# Altium schematic sheet FumSegwayMainBoard.SchDoc
size C
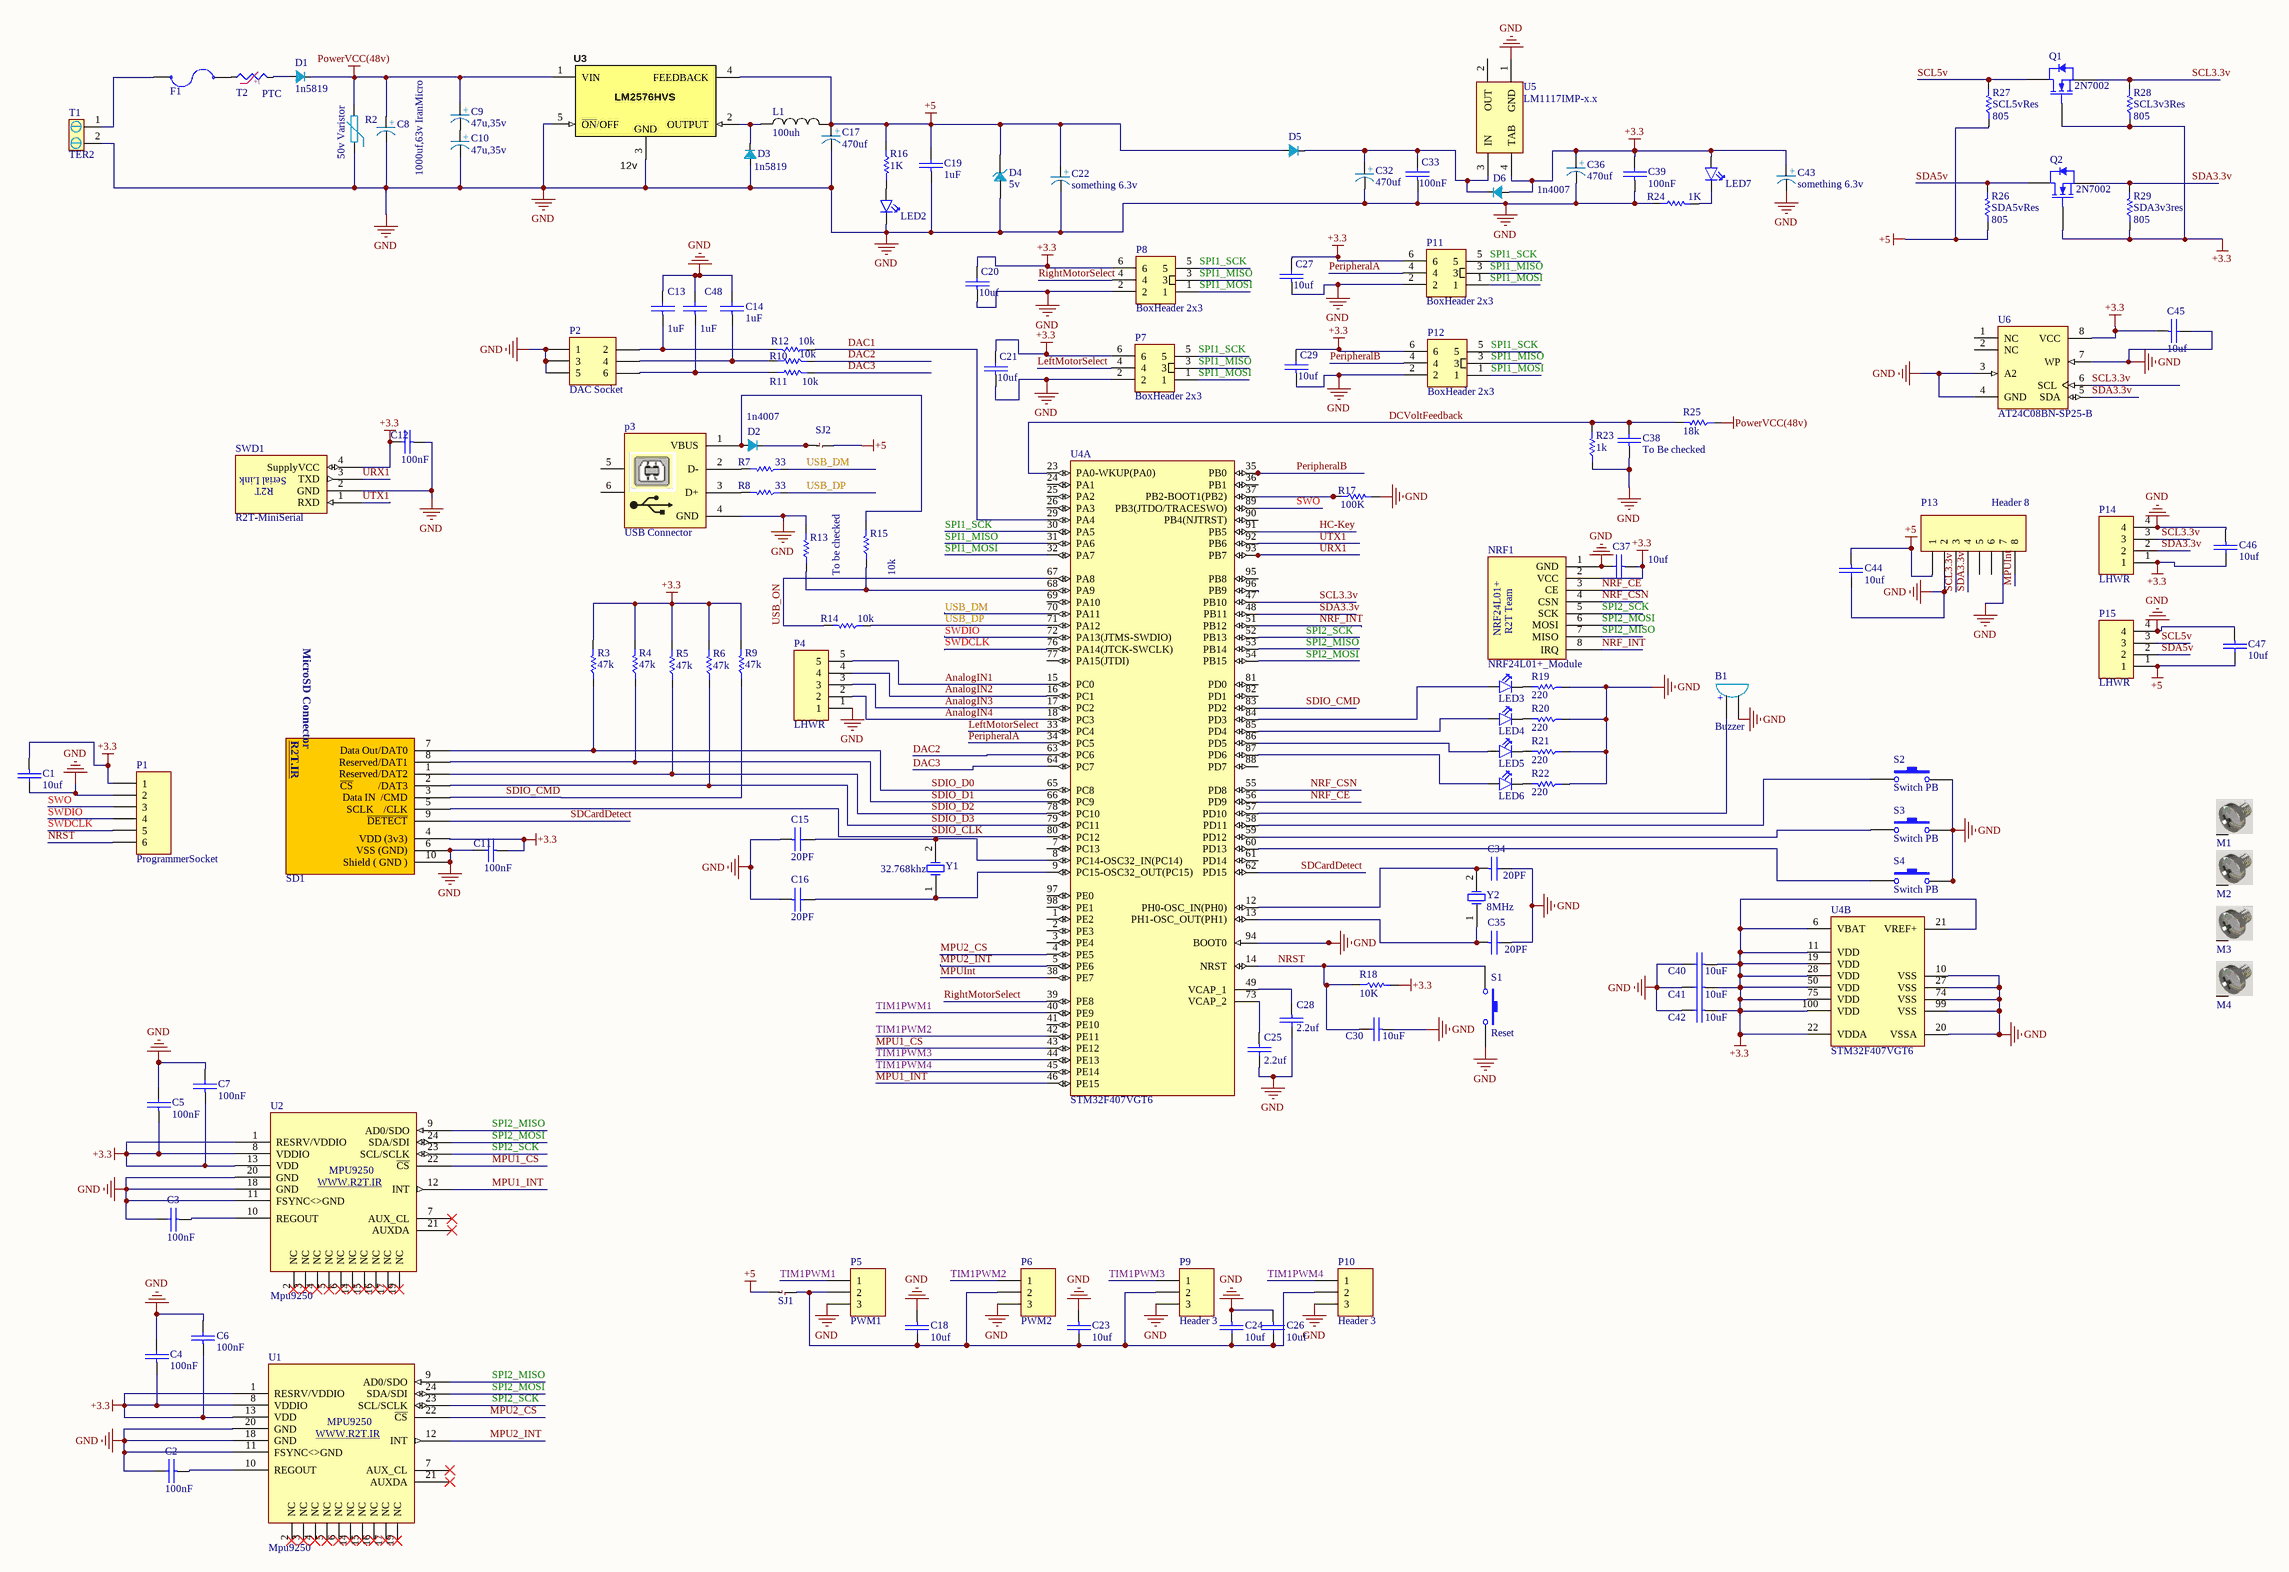
[diagram p0: FumSegwayMainBoard.SchDoc]

## Parts
B1  Buzzer  [Buzzer]
C1  10uf  [SMD_CAP_1206]
C2  100nF  [SMD_CAP_0805]
C3  100nF  [SMD_CAP_0805]
C4  100nF  [SMD_CAP_0805]
C5  100nF  [SMD_CAP_0805]
C6  100nF  [SMD_CAP_0805]
C7  100nF  [SMD_CAP_0805]
C8  Description:: 1000uf,63v IranMicro  [Cap Radial 16MM HV]  (hidden comment: Capacitor Polarized)
C9  Description:: 47u,35v  [Tantalum CAP Size E - 2917]  (hidden comment: Capacitor Polarized)
C10  Description:: 47u,35v  [Tantalum CAP Size E - 2917]  (hidden comment: Capacitor Polarized)
C11  100nF  [SMD_CAP_0805]
C12  100nF  [SMD_CAP_0805]
C13  1uF  [SMD_CAP_1206]
C14  1uF  [SMD_CAP_1206]
C15  20PF  [SMD_CAP_0805]
C16  20PF  [SMD_CAP_0805]
C17  Description:: 470uf  [Electrolytic Capacitor SMD Dia-8]  (hidden comment: Capacitor Polarized)
C18  10uf  [SMD_CAP_1206]
C19  1uF  [SMD_CAP_1206]
C20  10uf  [SMD_CAP_1206]
C21  10uf  [SMD_CAP_1206]
C22  Description:: something 6.3v  [Tantalum Cap Size A - 1206]  (hidden comment: Capacitor Polarized)
C23  10uf  [SMD_CAP_1206]
C24  10uf  [SMD_CAP_1206]
C25  2.2uf  [SMD_CAP_0805]
C26  10uf  [SMD_CAP_1206]
C27  10uf  [SMD_CAP_1206]
C28  2.2uf  [SMD_CAP_0805]
C29  10uf  [SMD_CAP_1206]
C30  10uF  [SMD_CAP_0805]
C32  Description:: 470uf  [Electrolytic Capacitor SMD Dia-8]  (hidden comment: Capacitor Polarized)
C33  100nF  [SMD_CAP_0805]
C34  20PF  [SMD_CAP_0805]
C35  20PF  [SMD_CAP_0805]
C36  Description:: 470uf  [Electrolytic Capacitor SMD Dia-8]  (hidden comment: Capacitor Polarized)
C37  10uf  [SMD_CAP_1206]
C38  To Be checked  [SMD_CAP_1206]
C39  100nF  [SMD_CAP_0805]
C40  10uF  [SMD_CAP_0805]
C41  10uF  [SMD_CAP_0805]
C42  10uF  [SMD_CAP_0805]
C43  Description:: something 6.3v  [Tantalum Cap Size A - 1206]  (hidden comment: Capacitor Polarized)
C44  10uf  [SMD_CAP_1206]
C45  10uf  [SMD_CAP_0805]
C46  10uf  [SMD_CAP_1206]
C47  10uf  [SMD_CAP_1206]
C48  1uF  [SMD_CAP_1206]
D1  Description:: 1n5819  [DO-214AC ( SMD Diode )]  (hidden comment: SMD Diodes)
D2  Description:: 1n4007  [DO-214AC ( SMD Diode )]  (hidden comment: SMD Diodes)
D3  Description:: 1n5819  [DO-214AC ( SMD Diode )]  (hidden comment: SMD Diodes)
D4  5v  [DIOMELF3615N]
D5  SMD Diodes  [DO-214AC ( SMD Diode )]  (value not drawn)
D6  Description:: 1n4007  [DO-214AC ( SMD Diode )]  (hidden comment: SMD Diodes)
F1  Fuse  [Fuse 5x20MM]  (value not drawn)
L1  100uh  [General 10x12(200m) Inductor]
LED2  LED  [LED0805]  (value not drawn)
LED3  LED  [LED0805]  (value not drawn)
LED4  LED  [LED0805]  (value not drawn)
LED5  LED  [LED0805]  (value not drawn)
LED6  LED  [LED0805]  (value not drawn)
LED7  LED  [LED0805]  (value not drawn)
M1  Screw  [Board Screw]  (value not drawn)
M2  Screw  [Board Screw]  (value not drawn)
M3  Screw  [Board Screw]  (value not drawn)
M4  Screw  [Board Screw]  (value not drawn)
NRF1  NRF24L01+_Module  [NRF24L01P_SMD]
P1  ProgrammerSocket  [HDR1X6]
P2  DAC Socket  [HDR2X3]
p3  USB Connector  [USB2.5-2H4F]
P4  LHWR  [Polarized Header 5]
P5  PWM1  [HDR1X3]
P6  PWM2  [HDR1X3]
P7  BoxHeader 2x3  [Box Header 2x3]
P8  BoxHeader 2x3  [Box Header 2x3]
P9  Header 3  [HDR1X3]
P10  Header 3  [HDR1X3]
P11  BoxHeader 2x3  [Box Header 2x3]
P12  BoxHeader 2x3  [Box Header 2x3]
P13  Header 8  [HDR1X8]
P14  LHWR  [Polarized Header 4]
P15  LHWR  [Polarized Header 4]
Q1  2N7002  [SOT23_N]
Q2  2N7002  [SOT23_N]
R2  50v Varistor  [VAR07]
R3  47k  [RES 0805 (2012X06L)]
R4  47k  [RES 0805 (2012X06L)]
R5  47k  [RES 0805 (2012X06L)]
R6  47k  [RES 0805 (2012X06L)]
R7  33  [RES 0805 (2012X06L)]
R8  33  [RES 0805 (2012X06L)]
R9  47k  [RES 0805 (2012X06L)]
R10  10k  [RES 0805 (2012X06L)]
R11  10k  [RES 0805 (2012X06L)]
R12  10k  [RES 0805 (2012X06L)]
R13  To be checked  [RES 0805 (2012X06L)]
R14  10k  [RES 0805 (2012X06L)]
R15  10k  [RES 0805 (2012X06L)]
R16  1K  [RES 0805 (2012X06L)]
R17  100K  [RES 0805 (2012X06L)]
R18  10K  [RES 0805 (2012X06L)]
R19  220  [RES 0805 (2012X06L)]
R20  220  [RES 0805 (2012X06L)]
R21  220  [RES 0805 (2012X06L)]
R22  220  [RES 0805 (2012X06L)]
R23  1k  [RES 0805 (2012X06L)]
R24  1K  [RES 0805 (2012X06L)]
R25  18k  [RES 0805 (2012X06L)]
R26  Tolerance: 805  [RES 0805 (2012X06L)]  (hidden comment: SDA5vRes)
R27  Tolerance: 805  [RES 0805 (2012X06L)]  (hidden comment: SCL5vRes)
R28  Tolerance: 805  [RES 0805 (2012X06L)]  (hidden comment: SCL3v3Res)
R29  Tolerance: 805  [RES 0805 (2012X06L)]  (hidden comment: SDA3v3res)
S1  Reset  [SW-PB]
S2  Switch PB  [SW-PB]
S3  Switch PB  [SW-PB]
S4  Switch PB  [SW-PB]
SD1  MicroSD Card Connector  [MicroSD Card Connector]  (value not drawn)
SJ1  SmdJumper  [SMD Jumper]  (value not drawn)
SJ2  SmdJumper  [SMD Jumper]  (value not drawn)
SWD1  R2T-MiniSerial  [SerialWireMini]
T1  TER2  [TER2]
T2  PTC  [PTC Radial 5mm]
U1  Mpu9250  [MPU9250]
U2  Mpu9250  [MPU9250]
U3  value 12v  [TO-263-5]  (hidden comment: Adjustable)
U4  STM32F407VGT6  [STM-LQFP100_N]  (parts A,B of 2)
U5  LM1117IMP-x.x  [MP04A_N]
U6  AT24C08BN-SP25-B  [8S1_N]
Y1  32.768khz  [XTAL RTC]
Y2  8MHz  [XTAL Small]

## Nets
+3.3: C1.2(-) C4.2(-) C5.2(-) C6.2(-) C7.2(-) C11.2(-) C12.1(+) C20.1(+) C21.1(+) C27.1(+) C29.1(+) C36.1 C37.2(-) C39.1(+) C40.2(-) C41.2(-) C42.2(-) C43.1 C45.2(-) C46.1(+) D6.0 LED7.1(A) NRF1.2(VCC) P1.1 P7.6 P8.6 P11.6 P12.6 P14.1 Q1.1(G) Q2.1(G) R3.2 R4.2 R5.2 R6.2 R9.2 R18.2 R28.1 R29.1 SD1.4(VDD_(3v3)) SWD1.4(SupplyVCC) U1.1(RESRV/VDDIO) U1.8(VDDIO) U1.13(VDD) U2.1(RESRV/VDDIO) U2.8(VDDIO) U2.13(VDD) U4.6(VBAT) U4.11(VDD) U4.19(VDD) U4.21(VREF+) U4.22(VDDA) U4.28(VDD) U4.50(VDD) U4.75(VDD) U4.100(VDD) U5.4(TAB) U6.8(VCC)
+5: C17.1 C19.1(+) C22.1 C44.2(-) C47.1(+) D4.1 D5.0 L1.0 P13.1 P15.1 R16.1 R26.1 R27.1 SJ1.1 SJ2.2 U3.4(FEEDBACK)
GND: B1.2(GND) C1.1(+) C2.1(+) C3.1(+) C4.1(+) C5.1(+) C6.1(+) C7.1(+) C8.2 C10.2 C11.1(+) C12.2(-) C13.1(+) C14.1(+) C15.2(-) C16.2(-) C17.2 C18.2(-) C19.2(-) C20.2(-) C21.2(-) C22.2 C23.2(-) C24.2(-) C25.1(+) C26.2(-) C27.2(-) C28.1(+) C29.2(-) C30.2(-) C32.2 C33.2(-) C34.1(+) C35.1(+) C36.2 C37.1(+) C38.2(-) C39.2(-) C40.1(+) C41.1(+) C42.1(+) C43.2 C44.1(+) C45.1(+) C46.2(-) C47.2(-) C48.1(+) D3.0 D4.2 LED2.2(K) NRF1.1(GND) P1.2 P2.1 P2.3 P2.5 p3.4(GND) P4.1 P5.3 P6.3 P7.2 P8.2 P9.3 P10.3 P11.2 P12.2 P13.2 P13.7 P14.4 P15.4 R2.1 R13.2 R17.2 R19.1 R20.1 R21.1 R22.1 R23.1 R24.1 S1.2 S2.2 S3.2 S4.2 SD1.6(VSS_(GND)) SD1.10(Shield_(_GND_)) SWD1.2(GND) T1.2 U1.11(FSYNC<>GND) U1.18(GND) U1.20(GND) U2.11(FSYNC<>GND) U2.18(GND) U2.20(GND) U3.3(GND) U3.5(~{ON}/OFF) U4.10(VSS) U4.20(VSSA) U4.27(VSS) U4.74(VSS) U4.94(BOOT0) U4.99(VSS) U5.1(GND) U6.3(A2) U6.4(GND) U6.7(WP)
PowerVCC(48v): C8.1 C9.1 D1.1 R2.2 R25.1 U3.1(VIN)
AnalogIN1: P4.5 U4.15(PC0)
AnalogIN2: P4.4 U4.16(PC1)
AnalogIN3: P4.3 U4.17(PC2)
AnalogIN4: P4.2 U4.18(PC3)
DAC1: R12.2 U4.29(PA4)
DAC2: R10.1 U4.63(PC6)
DAC3: R11.1 U4.64(PC7)
DCVoltFeedback: C38.1(+) R23.2 R25.2 U4.23(PA0-WKUP(PA0))
HC-Key: U4.91(PB5)
LeftMotorSelect: P7.4 U4.33(PC4)
MPU1_CS: U2.22(~{CS}) U4.43(PE12)
MPU1_INT: U2.12(INT) U4.46(PE15)
MPU2_CS: U1.22(~{CS}) U4.4(PE5)
MPU2_INT: U1.12(INT) U4.5(PE6)
MPUInt: P13.8 U4.38(PE7)
NRF_CE: NRF1.3(CE) U4.56(PD9)
NRF_CSN: NRF1.4(CSN) U4.55(PD8)
NRF_INT: NRF1.8(IRQ) U4.51(PB12)
NRST: C30.1(+) P1.6 R18.1 S1.1 U4.14(NRST)
PeripheralA: P11.4 U4.34(PC5)
PeripheralB: P12.4 U4.35(PB0)
RightMotorSelect: P8.4 U4.39(PE8)
SCL3.3v: P13.3 P14.3 Q1.2(S) R28.2 U4.47(PB10) U6.6(SCL)
SCL5v: P15.3 Q1.3(D) R27.2
SDA3.3v: P13.4 P14.2 Q2.2(S) R29.2 U4.48(PB11) U6.5(SDA)
SDA5v: P15.2 Q2.3(D) R26.2
SDCardDetect: SD1.9(~{DETECT}) U4.62(PD15)
SDIO_CLK: SD1.5(SCLK____/CLK) U4.80(PC12)
SDIO_CMD: R9.1 SD1.3(Data_IN__/CMD) U4.83(PD2)
SDIO_D0: R3.1 SD1.7(Data_Out/DAT0) U4.65(PC8)
SDIO_D1: R4.1 SD1.8(Reserved/DAT1) U4.66(PC9)
SDIO_D2: R5.1 SD1.1(Reserved/DAT2) U4.78(PC10)
SDIO_D3: R6.1 SD1.2(~{CS}__________/DAT3) U4.79(PC11)
SPI1_MISO: P7.3 P8.3 P11.3 P12.3 U4.31(PA6)
SPI1_MOSI: P7.1 P8.1 P11.1 P12.1 U4.32(PA7)
SPI1_SCK: P7.5 P8.5 P11.5 P12.5 U4.30(PA5)
SPI2_MISO: NRF1.7(MISO) U1.9(AD0/SDO) U2.9(AD0/SDO) U4.53(PB14)
SPI2_MOSI: NRF1.6(MOSI) U1.24(SDA/SDI) U2.24(SDA/SDI) U4.54(PB15)
SPI2_SCK: NRF1.5(SCK) U1.23(SCL/SCLK) U2.23(SCL/SCLK) U4.52(PB13)
SWDCLK: P1.5 U4.76(PA14(JTCK-SWCLK))
SWDIO: P1.4 U4.72(PA13(JTMS-SWDIO))
SWO: P1.3 U4.89(PB3(JTDO/TRACESWO))
TIM1PWM1: P5.1 U4.40(PE9)
TIM1PWM2: P6.1 U4.42(PE11)
TIM1PWM3: P9.1 U4.44(PE13)
TIM1PWM4: P10.1 U4.45(PE14)
URX1: SWD1.3(TXD) U4.93(PB7)
USB_DM: R7.1 U4.70(PA11)
USB_DP: R8.1 R14.1 U4.71(PA12)
USB_ON: R14.2 U4.67(PA8)
UTX1: SWD1.1(RXD) U4.92(PB6)
NetB1_1: B1.1(VCC) U4.57(PD10)
NetC2_2: C2.2(-) U1.10(REGOUT)
NetC3_2: C3.2(-) U2.10(REGOUT)
NetC9_2: C9.2 C10.1
NetC13_2: C13.2(-) P2.2 R12.1
NetC14_2: C14.2(-) P2.4 R10.2
NetC15_1: C15.1(+) U4.8(PC14-OSC32_IN(PC14)) Y1.2(OSC2)
NetC16_1: C16.1(+) U4.9(PC15-OSC32_OUT(PC15)) Y1.1(OSC1)
NetC18_1: C18.1(+) C23.1(+) C24.1(+) C26.1(+) P5.2 P6.2 P9.2 P10.2 SJ1.2
NetC25_2: C25.2(-) U4.73(VCAP_2)
NetC28_2: C28.2(-) U4.49(VCAP_1)
NetC32_1: C32.1 C33.1(+) D5.1 D6.1 U5.3(IN)
NetC34_2: C34.2(-) U4.12(PH0-OSC_IN(PH0)) Y2.2(OSC2)
NetC35_2: C35.2(-) U4.13(PH1-OSC_OUT(PH1)) Y2.1(OSC1)
NetC48_2: C48.2(-) P2.6 R11.2
NetD1_0: D1.0 T2.2
NetD2_0: D2.0 p3.1(VBUS) R15.2
NetD2_1: D2.1 SJ2.1
NetD3_1: D3.1 L1.1 U3.2(OUTPUT)
NetF1_1: F1.1 T1.1
NetF1_2: F1.2 T2.1
NetLED2_1: LED2.1(A) R16.2
NetLED3_1: LED3.1(A) U4.84(PD3)
NetLED3_2: LED3.2(K) R19.2
NetLED4_1: LED4.1(A) U4.85(PD4)
NetLED4_2: LED4.2(K) R20.2
NetLED5_1: LED5.1(A) U4.86(PD5)
NetLED5_2: LED5.2(K) R21.2
NetLED6_1: LED6.1(A) U4.87(PD6)
NetLED6_2: LED6.2(K) R22.2
NetLED7_2: LED7.2(K) R24.2
Netp3_2: p3.2(D-) R7.2
Netp3_3: p3.3(D+) R8.2
NetR13_1: R13.1 R15.1 U4.68(PA9)
NetR17_1: R17.1 U4.37(PB2-BOOT1(PB2))
NetS2_1: S2.1 U4.58(PD11)
NetS3_1: S3.1 U4.59(PD12)
NetS4_1: S4.1 U4.60(PD13)

Not connected (* = marked no-connect by the designer): M1 S; M2 S; M3 S; M4 S; p3 5 6; P13 5 6; U1 2(NC)* 3(NC)* 4(NC)* 5(NC)* 6(NC)* 7(AUX_CL)* 14(NC)* 15(NC)* 16(NC)* 17(NC)* 19(NC)* 21(AUXDA)*; U2 2(NC)* 3(NC)* 4(NC)* 5(NC)* 6(NC)* 7(AUX_CL)* 14(NC)* 15(NC)* 16(NC)* 17(NC)* 19(NC)* 21(AUXDA)*; U4 1(PE2) 2(PE3) 3(PE4) 7(PC13) 24(PA1) 25(PA2) 26(PA3) 36(PB1) 41(PE10) 61(PD14) 69(PA10) 77(PA15(JTDI)) 81(PD0) 82(PD1) 88(PD7) 90(PB4(NJTRST)) 95(PB8) 96(PB9) 97(PE0) 98(PE1); U5 2(OUT); U6 1(NC) 2(NC)

## Notes on the sheet
- (in symbol Buzzer) +
- (in symbol Capacitor Polarized) +
- (in symbol MicroSD Card Connector) MicroSD Connector; R2T.IR
- (in symbol MPU9250) WWW.R2T.IR
- (in symbol NRF24L01+_Module) R2T Team; NRF24L01+
- (in symbol PTC) +t
- (in symbol R2T-MiniSerial) Serial Link; R2T

## Library data of the parts
B1 = Buzzer: Designer: Hamed Jafarzadeh
C1-C7 C11-C16 C18-C21 C23-C30 C33-C35 C37-C42 C44-C48 = Cap-Bipolar: Bipolar Capacitor; Voltage: 100V; Designer: Saeid Jorablo; Organazation: ControTec; Adding Date: 1387/12/20
  C1 C18 C20 C21 C23 C24 C26 C27 C29 C37 C44-C47: Value: 10uf
  C2-C7 C11 C12 C33 C39: Value: 100nF
  C13 C14 C19 C48: Value: 1uF
  C15 C16 C34 C35: Value: 20PF
  C25 C28: Value: 2.2uf
  C30 C40-C42: Value: 10uF
  C38: Value: To Be checked
C8-C10 C17 C22 C32 C36 C43 = Capacitor Polarized: Designer: Hamed Jafarzadeh ( R2T )
D1-D3 D6 = SMD Diodes: Designer :: Hamed Jafarzadeh
D4 = Diode Zener SMD: Designer: Hamed Jafarzadeh
D5 = SMD Diodes: Designer :: Hamed Jafarzadeh; Description:: Diode
F1 = Fuse: Designer :: Hamed Jafarzadeh
L1 = Inductor: Designer:: Hamed Jafarzadeh - hjafarzadeh511@gmail.com
LED2-LED7 = LED: Designer :: Razi Research Team Of Mashhad - Hamed Jafarzadeh
M1-M4 = Board Screw: Board Screw With Spacer
NRF1 = NRF24L01+_Module: Designer:: HamedJafarzadeh
P1 = Header 6: Header, 6-Pin; LatestRevisionDate: 17-Jul-2002; LatestRevisionNote: Re-released for DXP Platform.; Publisher: Altium Limited
P2 = Header 3X2: Header, 3-Pin, Dual row; LatestRevisionDate: 17-Jul-2002; LatestRevisionNote: Re-released for DXP Platform.; Publisher: Altium Limited
p3 = USB: USB Connector-B Type; Designer: Eng. Saeid Jorablo; Company: DASE Co; Adding Date: 10/26/2010
P4 = 5pin LHWR: Designer:: Hamed Jafarzadeh - www.R2T.ir
P5 P6 P9 P10 = Header 3: Header, 3-Pin; LatestRevisionDate: 17-Jul-2002; LatestRevisionNote: Re-released for DXP Platform.; Publisher: Altium Limited
P7 P8 P11 P12 = BoxHeader 2x3: Designer: HamedJafarzadeh - ww.R2T.ir
P13 = Header 8: Header, 8-Pin; LatestRevisionDate: 17-Jul-2002; LatestRevisionNote: Re-released for DXP Platform.; Publisher: Altium Limited
P14 P15 = 4pin LHWR: Designer:: Hamed Jafarzadeh - www.R2T.ir
Q1 Q2 = 2N7002: N-channel Enhancement Mode Field-effect Transistor; Published: 17-Sep-2003; LatestRevisionDate: 12-Dec-2006; LatestRevisionNote: IPC-7351 Footprint Added.; DatasheetVersion: 27-Jul-2000; PackageVersion: May-1999; PackageReference: SOT23; Publisher: Altium Limited; PackageDescription: 3-Pin SOT-23 Package 0.95 mm Pitch, 2.3 mm Lead Span; ComponentLink1Description: Manufacturer Link; ComponentLink1URL: http://www.semiconductors.philips.com/; ComponentLink2Description: Datasheet; ComponentLink2URL: http://www.semiconductors.philips.com/acrobat/datasheets/2N7002_4.pdf
R2 = VARISTOR
R3-R12 R14 R16-R25 = Resistor: Tolerance: 5%; Power: 1/8 W
  R3-R6 R9: Value: 47k
  R7 R8: Value: 33
  R10-R12 R14: Value: 10k
  R16 R24: Value: 1K
  R17: Value: 100K
  R18: Value: 10K
  R19-R22: Value: 220
  R23: Value: 1k
  R25: Value: 18k
R13 R15 R26-R29 = Resistor
  R13: Value: To be checked
  R15: Value: 10k
  R26: Value: SDA5vRes
  R27: Value: SCL5vRes
  R28: Value: SCL3v3Res
  R29: Value: SDA3v3res
S1-S4 = Switch PB: Push Button Switch
SD1 = MicroSD Card Connector: Designer:: Hamed Jafarzadeh - R2T.IR
T2 = PTC: Designer: Hamed Jafarzadeh
U1 U2 = MPU9250: Nine Axis IMU; Designer:: Hamed Jafarzadeh
U3 = LM2576HVS: Switching Voltage Regulator IC, TO-263-5 SMD, LM2591HVS-5.0; Manufacturer 1: National Semiconductor; Voltage Regulator Type: Switching Buck; Tolerance: ±4%; Ratings: 60Vin Max; 150kHz; SCDType: source; Package / Case: TO-263-5; Supplier 1: Digi-Key; Supplier Part Number 1: LM2591HVS-5.0-ND; Manufacturer Part Number 1: LM2576HVS
U4 = STM32F407VGT6: ARM Cortex-M4 32-bit MCU+FPU, 210 DMIPS, 1024 kB Flash, 192 kB Internal RAM, 82 I/Os, 100-pin LQFP, -40 to 85 degC, Tray; Manufacturer: STMicroelectronics; D/A Converter: 2x12-bit; FLASH Size (Prog) (kB): 1024; I/Os (High Current): 82; Internal RAM Size (kB): 192; Operating Frequency(F) (Processor speed) (MHz): 168; Supply Voltage(Vcc) max (V): 3.6; Supply Voltage(Vcc) min (V): 1.8; DatasheetVersion: Rev. 4; PackageVersion: Rev. 1, 06/2013; PackageReference: LQFP100; PackageDescription: 100-Pin Low Profile Quad Flat Package, 14 x 14 mm Body, 0.5 mm Pitch; Supplier 1: Digi-Key; Supplier Part Number 1: 497-11605-ND; Supplier 2: Farnell; Supplier Part Number 2: 2064368; Supplier 3: Newark; Supplier Part Number 3: 73T2333; Supplier 4: Mouser; Supplier Part Number 4: 511-STM32F407VGT6; Core: ARM Cortex-M4; Packing: Tray; Mounting Technology: Surface Mount; PartNumber: STM32F407VGT6; ComponentLink1Description: Manufacturer URL; ComponentLink1URL: http://www.st.com/web/en/home.html; ComponentLink2Description: Datasheet; ComponentLink2URL: http://www.st.com/st-web-ui/static/active/en/resource/technical/document/datasheet/DM00037051.pdf; ComponentLink3Description: Package Specification; ComponentLink3URL: http://www.st.com/st-web-ui/static/active/en/resource/technical/document/data_brief/DM00071938.pdf
U5 = LM1117IMP-x.x: x.x Volt, 800mA Low-Dropout Linear Regulator, 4-pin SOT-223; PartNumber: LM1117IMP-3.3; Manufacturer: National Semiconductor; PackageTopMarking: XYTT*N05B; PowerWise: N; CompType: LDO IC; Published: 4-Dec-2008; DatasheetVersion: Apr-2006; PackageVersion: revB, Apr-2003; PackageReference: MP04A; Publisher: Altium Limited; PackageDescription: Molded SOT-223, 6.50 x 3.56 x 1.6mm Body, 4 Lead, 2.3mm Pitch; Supplier 1: Farnell; Supplier Part Number 1: 7614123; RoHS: N; PinCount: 4; Code_JEDEC: TO-261-AA; Code_IPC: SOT223-4; ComponentLink1Description: LM1117 Datasheet; ComponentLink1URL: http://www.national.com/ds/LM/LM1117.pdf; ComponentLink2Description: LM1117 Web Page; ComponentLink2URL: http://www.national.com/pf/LM/LM1117.html; ComponentLink3Description: MP04A Package Page; ComponentLink3URL: http://www.national.com/packaging/folders/mp04a.html
U6 = AT24C08BN-SP25-B: 8Kbit (1024 x 8), 2-wire Bus Automotive Serial EEPROM with Write Protect, 2.5V, 8-Pin SOIC, Bulk; DatasheetVersion: 8517C,  Jan-2009; PackageVersion: revC, Mar-2005; PackageReference: 8S1; PackageDescription: 8-Lead (0.150" Wide Body), Plastic Gull Wing Small Outline (JEDEC SOIC); Code_JEDEC: MS-012-AA; Code_IPC: SOIC127P600-8; ComponentLink1Description: Manufacturer URL; ComponentLink1URL: http://www.atmel.com/; ComponentLink2Description: Datasheet; ComponentLink2URL: http://www.atmel.com/dyn/resources/prod_documents/doc8517.pdf
Y1 Y2 = XTAL: XTAL Crystal; Company: E.P.I.L; Design Date: 11/04/2011
  Y1: Value: 32.768khz
  Y2: Value: 8MHz